# Altium project BEE_BOARD.PrjPcb (part 2 of 2)

## Sheet BEE_BOARD_DECAWAVE.SchDoc
size Tabloid; DocumentNumber: 7; SheetNumber: 7; SheetTotal: 7; Sheet_Name: DECAWAVE; Size: 11x17
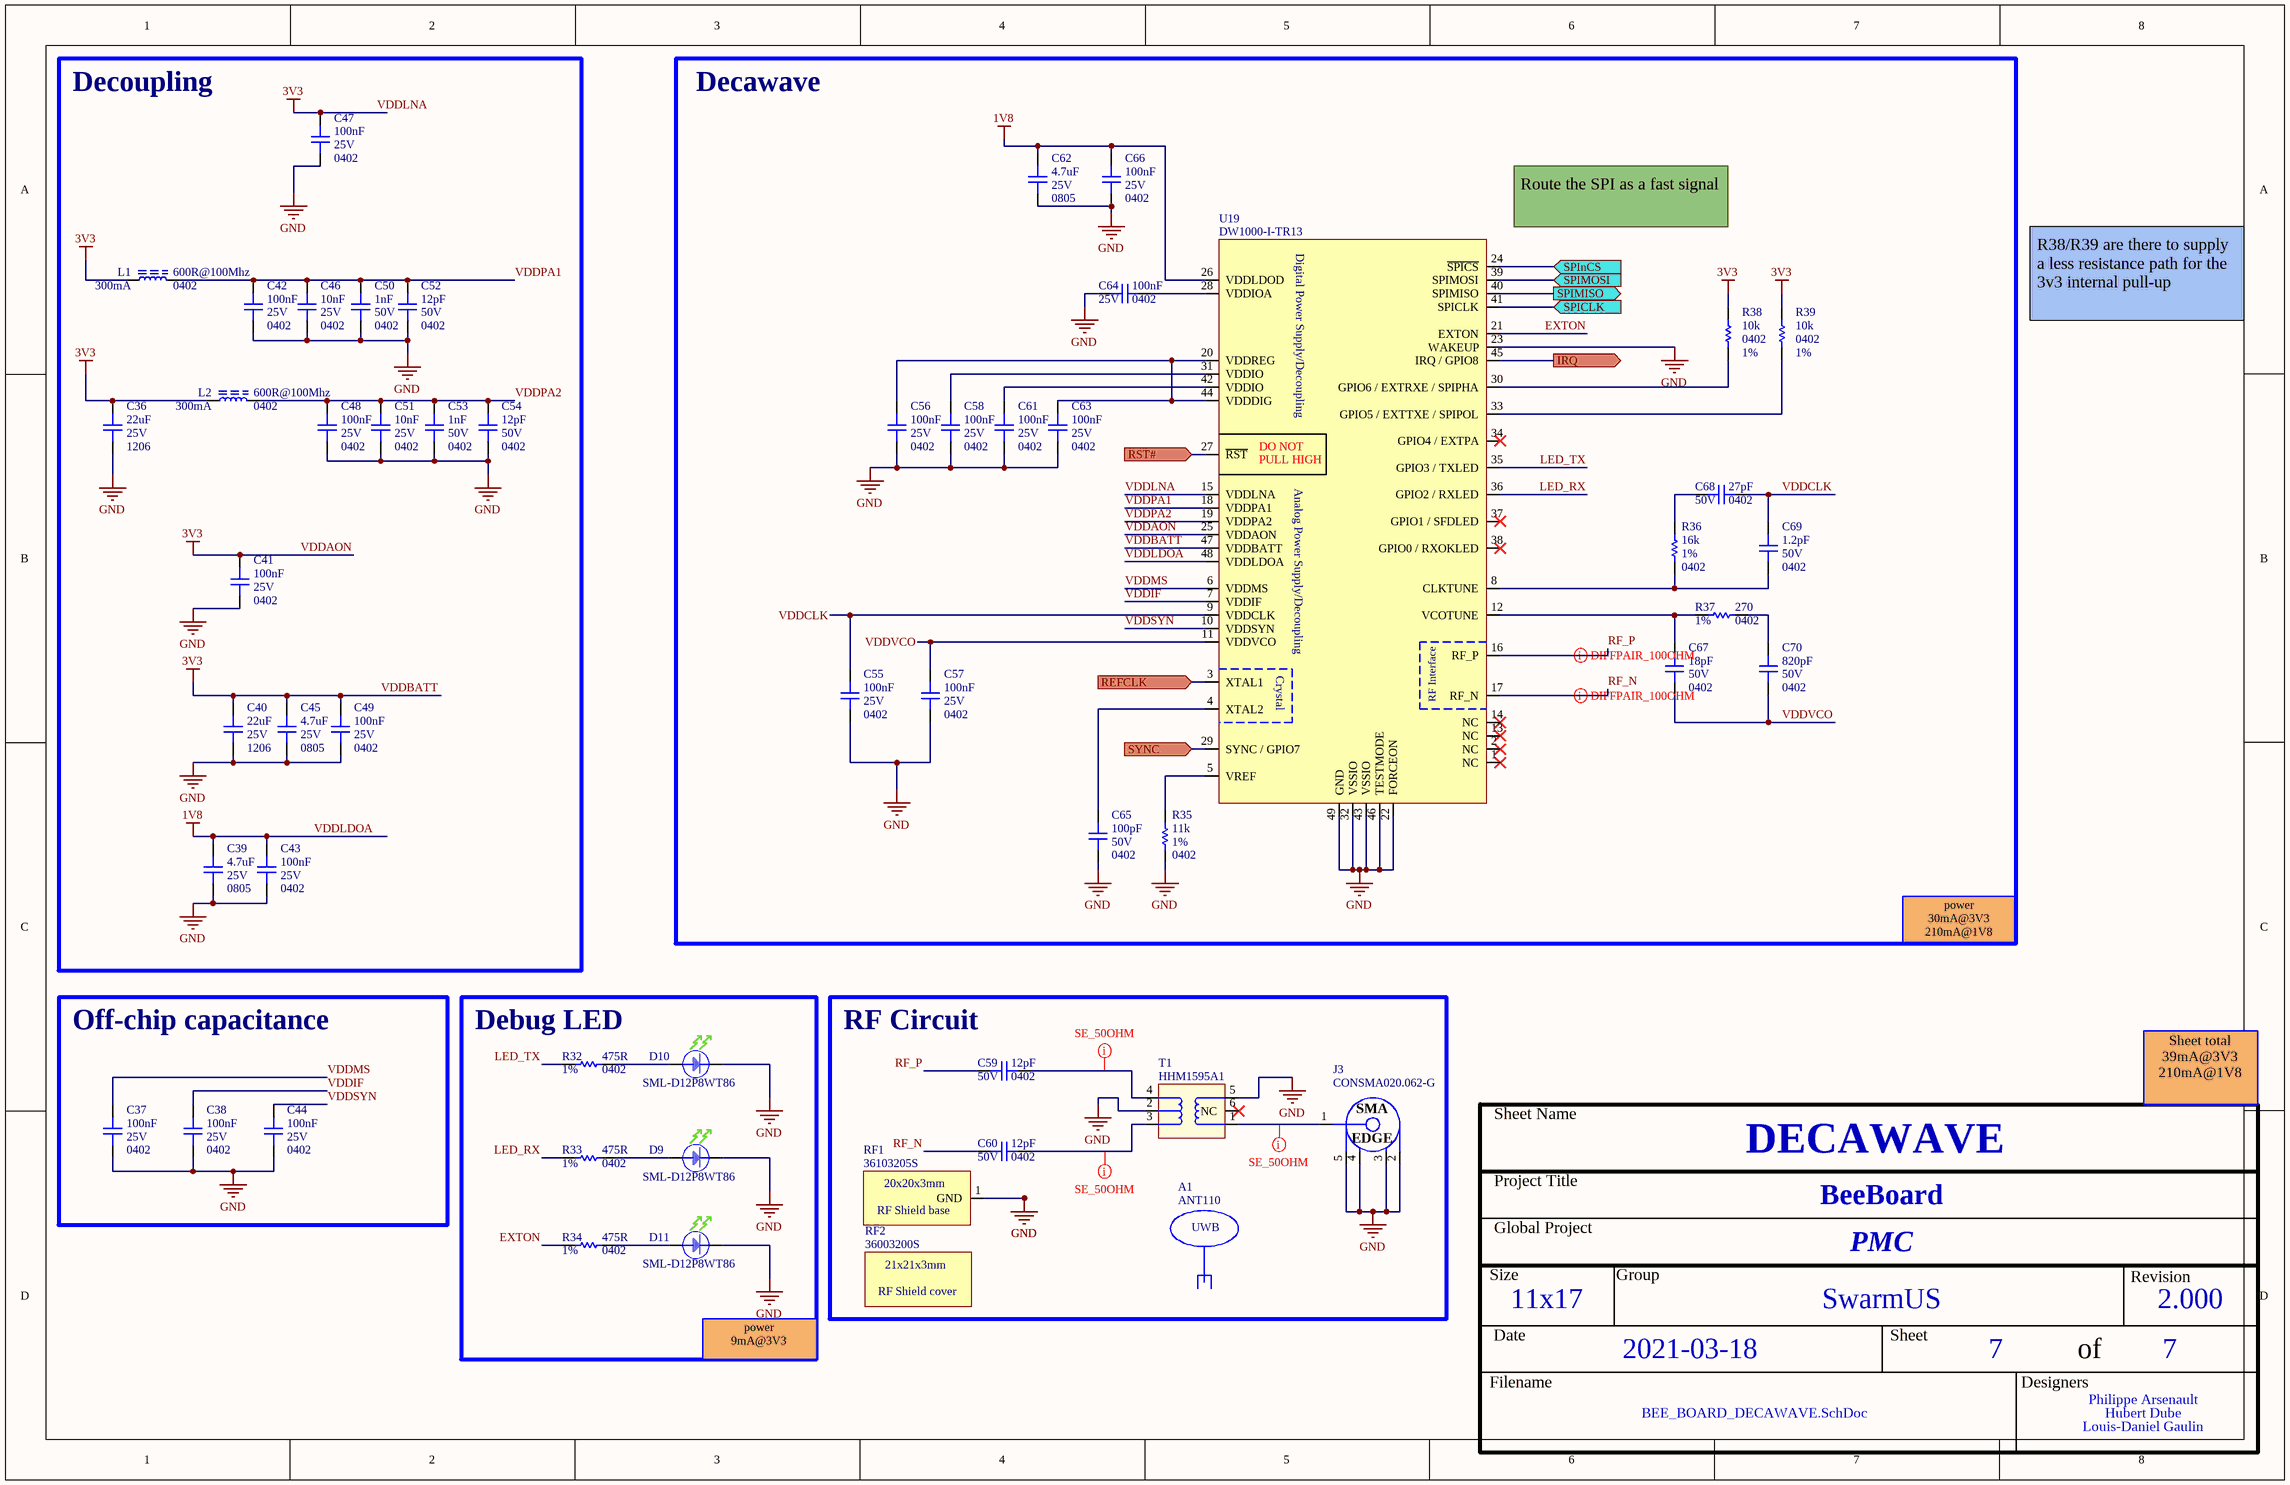
[diagram p4: BEE_BOARD_DECAWAVE.SchDoc]

### Parts
A1  ANT110  (mechanical)
C36  value 22uF  Package: 1206  Voltage Rating: 25V  [CAP_CER_1206]  (hidden comment: CL31A226KAHNNNE)
C37  value 100nF  Package: 0402  Voltage Rating: 25V  [CAP_CER_0402]  (hidden comment: CGA2B3X7R1E104K050BB)
C38  value 100nF  Package: 0402  Voltage Rating: 25V  [CAP_CER_0402]  (hidden comment: CGA2B3X7R1E104K050BB)
C39  value 4.7uF  Package: 0805  Voltage Rating: 25V  [CAP_CER_0805]  (hidden comment: C2012X7R1E475K125AE)
C40  value 22uF  Package: 1206  Voltage Rating: 25V  [CAP_CER_1206]  (hidden comment: CL31A226KAHNNNE)
C41  value 100nF  Package: 0402  Voltage Rating: 25V  [CAP_CER_0402]  (hidden comment: CGA2B3X7R1E104K050BB)
C42  value 100nF  Package: 0402  Voltage Rating: 25V  [CAP_CER_0402]  (hidden comment: CGA2B3X7R1E104K050BB)
C43  value 100nF  Package: 0402  Voltage Rating: 25V  [CAP_CER_0402]  (hidden comment: CGA2B3X7R1E104K050BB)
C44  value 100nF  Package: 0402  Voltage Rating: 25V  [CAP_CER_0402]  (hidden comment: CGA2B3X7R1E104K050BB)
C45  value 4.7uF  Package: 0805  Voltage Rating: 25V  [CAP_CER_0805]  (hidden comment: C2012X7R1E475K125AE)
C46  value 10nF  Package: 0402  Voltage Rating: 25V  [CAP_CER_0402]  (hidden comment: CL05B103KA5NNNC)
C47  value 100nF  Package: 0402  Voltage Rating: 25V  [CAP_CER_0402]  (hidden comment: CGA2B3X7R1E104K050BB)
C48  value 100nF  Package: 0402  Voltage Rating: 25V  [CAP_CER_0402]  (hidden comment: CGA2B3X7R1E104K050BB)
C49  value 100nF  Package: 0402  Voltage Rating: 25V  [CAP_CER_0402]  (hidden comment: CGA2B3X7R1E104K050BB)
C50  value 1nF  Package: 0402  Voltage Rating: 50V  [CAP_CER_0402]  (hidden comment: CC0402KRX7R9BB102)
C51  value 10nF  Package: 0402  Voltage Rating: 25V  [CAP_CER_0402]  (hidden comment: CL05B103KA5NNNC)
C52  value 12pF  Package: 0402  Voltage Rating: 50V  [CAP_CER_0402]  (hidden comment: CC0402JRNPO9BN120)
C53  value 1nF  Package: 0402  Voltage Rating: 50V  [CAP_CER_0402]  (hidden comment: CC0402KRX7R9BB102)
C54  value 12pF  Package: 0402  Voltage Rating: 50V  [CAP_CER_0402]  (hidden comment: CC0402JRNPO9BN120)
C55  value 100nF  Package: 0402  Voltage Rating: 25V  [CAP_CER_0402]  (hidden comment: CGA2B3X7R1E104K050BB)
C56  value 100nF  Package: 0402  Voltage Rating: 25V  [CAP_CER_0402]  (hidden comment: CGA2B3X7R1E104K050BB)
C57  value 100nF  Package: 0402  Voltage Rating: 25V  [CAP_CER_0402]  (hidden comment: CGA2B3X7R1E104K050BB)
C58  value 100nF  Package: 0402  Voltage Rating: 25V  [CAP_CER_0402]  (hidden comment: CGA2B3X7R1E104K050BB)
C59  value 12pF  Package: 0402  Voltage Rating: 50V  [CAP_CER_0402]  (hidden comment: CC0402JRNPO9BN120)
C60  value 12pF  Package: 0402  Voltage Rating: 50V  [CAP_CER_0402]  (hidden comment: CC0402JRNPO9BN120)
C61  value 100nF  Package: 0402  Voltage Rating: 25V  [CAP_CER_0402]  (hidden comment: CGA2B3X7R1E104K050BB)
C62  value 4.7uF  Package: 0805  Voltage Rating: 25V  [CAP_CER_0805]  (hidden comment: C2012X7R1E475K125AE)
C63  value 100nF  Package: 0402  Voltage Rating: 25V  [CAP_CER_0402]  (hidden comment: CGA2B3X7R1E104K050BB)
C64  value 100nF  Package: 0402  Voltage Rating: 25V  [CAP_CER_0402]  (hidden comment: CGA2B3X7R1E104K050BB)
C65  value 100pF  Package: 0402  Voltage Rating: 50V  [CAP_CER_0402]  (hidden comment: CC0402JRNPO9BN101)
C66  value 100nF  Package: 0402  Voltage Rating: 25V  [CAP_CER_0402]  (hidden comment: CGA2B3X7R1E104K050BB)
C67  value 18pF  Package: 0402  Voltage Rating: 50V  [CAP_CER_0402]  (hidden comment: GRM1555C1H180GA01D)
C68  value 27pF  Package: 0402  Voltage Rating: 50V  [CAP_CER_0402]  (hidden comment: CC0402JRNPO9BN270)
C69  value 1.2pF  Package: 0402  Voltage Rating: 50V  [CAP_CER_0402]  (hidden comment: C0402C129C5GACTU)
C70  value 820pF  Package: 0402  Voltage Rating: 50V  [CAP_CER_0402]  (hidden comment: CC0402KRX7R9BB821)
D9  SML-D12P8WT86  [LED_SML-D12P8WT86]
D10  SML-D12P8WT86  [LED_SML-D12P8WT86]
D11  SML-D12P8WT86  [LED_SML-D12P8WT86]
J3  CONSMA020.062-G  [CON_SMA_CONSMA020.062-G]
L1  value 600R@100Mhz  Current Rating: 300mA  Package: 0402  [FER_0402]  (hidden comment: BLM15AG601SN1D)
L2  value 600R@100Mhz  Current Rating: 300mA  Package: 0402  [FER_0402]  (hidden comment: BLM15AG601SN1D)
R32  value 475R  Tolerance: 1%  Package: 0402  [RES_0402]  (hidden comment: ERJ-2RKF4750X)
R33  value 475R  Tolerance: 1%  Package: 0402  [RES_0402]  (hidden comment: ERJ-2RKF4750X)
R34  value 475R  Tolerance: 1%  Package: 0402  [RES_0402]  (hidden comment: ERJ-2RKF4750X)
R35  value 11k  Tolerance: 1%  Package: 0402  [RES_0402]  (hidden comment: RC0402FR-0711KL)
R36  value 16k  Tolerance: 1%  Package: 0402  [RES_0402]  (hidden comment: RC0402FR-0716KL)
R37  value 270  Tolerance: 1%  Package: 0402  [FER_0402]  (hidden comment: RC0402FR-07270RL)
R38  value 10k  Tolerance: 1%  Package: 0402  [RES_0402]  (hidden comment: RC0402FR-0710KL)
R39  value 10k  Tolerance: 1%  Package: 0402  [RES_0402]  (hidden comment: RC0402FR-0710KL)
RF1  36103205S  [RF_SH_BASE_36103205S]
RF2  36003200S  [RF_SH_COVER_36003200S]  (mechanical)
T1  HHM1595A1  [XFR_HHM1595A1]
U19  DW1000-I-TR13  [COM_XCV_DW1000-I-TR13]

### Blocks framed on the sheet
Decoupling: C36 C39-C43 C45-C54 L1 L2
Decawave: C55-C58 C61-C70 R35-R39 U19
Off-chip capacitance: C37 C38 C44
Debug LED: D9-D11 R32-R34
RF Circuit: A1 C59 C60 J3 RF1 RF2 T1

### Ports
IRQ (out), REFCLK (in), RST# (in), SPICLK (in), SPIMISO (out), SPIMOSI (in), SPInCS (in), SYNC (in)

### Nets
1V8: C39.2 C43.2 C62.2 C66.2 U19.26(VDDLDOD) U19.48(VDDLDOA)  [also labelled VDDLDOA]
3V3: C36.2 C40.2 C41.2 C45.2 C47.2 C49.2 L1.1 L2.1 R38.1 R39.1 U19.15(VDDLNA) U19.25(VDDAON) U19.47(VDDBATT)  [also labelled VDDAON, VDDBATT, VDDLNA]
GND: C36.1 C37.1 C38.1 C39.1 C40.1 C41.1 C42.1 C43.1 C44.1 C45.1 C46.1 C47.1 C48.1 C49.1 C50.1 C51.1 C52.1 C53.1 C54.1 C55.1 C56.1 C57.1 C58.1 C61.1 C62.1 C63.1 C64.2 C65.1 C66.1 D9.K D10.K D11.K J3.2 J3.3 J3.4 J3.5 R35.1 RF1.1(GND) T1.2(GND) T1.5 U19.22(FORCEON) U19.23(WAKEUP) U19.32(VSSIO) U19.43(VSSIO) U19.46(TESTMODE) U19.49(GND)
CLK_OUT: U19.3(XTAL1) ; port REFCLK
DW_IRQ_BB: U19.45(IRQ_/_GPIO8) ; port IRQ
DW_RESET_BB: U19.27(~{RST}) ; port RST#
EXTON: R34.2 U19.21(EXTON)
LED_RX: R33.2 U19.36(GPIO2_/_RXLED)
LED_TX: R32.2 U19.35(GPIO3_/_TXLED)
RF_N: C60.2 U19.17(RF_N)
RF_P: C59.2 U19.16(RF_P)
SPICLK: U19.41(SPICLK) ; port SPICLK
SPIMISO: U19.40(SPIMISO) ; port SPIMISO
SPIMOSI: U19.39(SPIMOSI) ; port SPIMOSI
SPInCS: U19.24(~{SPICS}) ; port SPInCS
SYNC: U19.29(SYNC_/_GPIO7) ; port SYNC
VDDCLK: C55.2 C68.1 C69.2 U19.9(VDDCLK)
VDDIF: C38.2 U19.7(VDDIF)
VDDMS: C37.2 U19.6(VDDMS)
VDDPA1: C42.2 C46.2 C50.2 C52.2 L1.2 U19.18(VDDPA1)
VDDPA2: C48.2 C51.2 C53.2 C54.2 L2.2 U19.19(VDDPA2)
VDDSYN: C44.2 U19.10(VDDSYN)
VDDVCO: C57.2 C67.1 C70.1 U19.11(VDDVCO)
NetC56_2: C56.2 C63.2 U19.20(VDDREG) U19.44(VDDDIG)
NetC58_2: C58.2 U19.31(VDDIO)
NetC59_1: C59.1 T1.4
NetC60_1: C60.1 T1.3
NetC61_2: C61.2 U19.42(VDDIO)
NetC64_1: C64.1 U19.28(VDDIOA)
NetC65_2: C65.2 U19.4(XTAL2)
NetC67_2: C67.2 R37.2 U19.12(VCOTUNE)
NetC68_2: C68.2 R36.2
NetC69_1: C69.1 R36.1 U19.8(CLKTUNE)
NetC70_2: C70.2 R37.1
NetD9_A: D9.A R33.1
NetD10_A: D10.A R32.1
NetD11_A: D11.A R34.1
NetJ3_1: J3.1 T1.1
NetR35_2: R35.2 U19.5(VREF)
NetR38_2: R38.2 U19.30(GPIO6_/_EXTRXE_/_SPIPHA)
NetR39_2: R39.2 U19.33(GPIO5_/_EXTTXE_/_SPIPOL)

Not connected (* = marked no-connect by the designer): T1 6(NC)*; U19 1(NC)* 2(NC)* 13(NC)* 14(NC)* 34(GPIO4_/_EXTPA)* 37(GPIO1_/_SFDLED)* 38(GPIO0_/_RXOKLED)*

### Layout directives
net class SE_50OHM: NetC59_1, NetC60_1, NetJ3_1
differential pair; differential pair class DIFF_100: RF_N, RF_P

### Notes on the sheet
- (near U19) Route the SPI as a fast signal
- R38/R39 are there to supply a less resistance path for the 3v3 internal pull-up
- power
  30mA@3V3
  210mA@1V8
- Sheet total
  39mA@3V3
  210mA@1V8
- power
  9mA@3V3
- Sheet Name
- Project Title
- Global Project
- Size
- Group
- Revision
- Date
- Sheet
- of
- Filename
- Designers
- (in symbol ANT_ANT110) UWB
- (in symbol COM_XCV_DW1000-I-TR13) Digital Power Supply/Decoupling; DO NOT; PULL HIGH; Analog Power Supply/Decoupling; Crystal; RF Interface
- (in symbol CON_SMA_CONSMA020.062-G) SMA; EDGE
- (in symbol RF_SH_BASE_36103205S) RF Shield base
- (in symbol RF_SH_COVER_36003200S) RF Shield cover

### Library data of the parts
A1 = ANT_ANT110: ANT - UWB antenna 3.2 to 7GHz; Manufacturer #1: Ciholas; GRAMS Lib Spec: 2.7; Polarized: No; HelpURL: https://cuwb.io/products/ant110.pdf; CreatedBy/Date: Philippe Arsenault/2021-04-11; VerifiedBy: Louis-Daniel Gaulin / 14-04-2021; Assembly Type: SMA; Part Number #1: ANT110; Supplier 1: Ciholas; Supplier Part Number 1: ANT110
C36 C40 = CAP_CER_CL31A226KAHNNNE: CAP - CER 22uF 10% 25V X5R - 1206; Manufacturer #1: Samsung Electro-Mechanics; GRAMS Lib Spec: 2.8; Magnetic Material: Unknown; Polarized: NO; Assembly Type: SMD; CreatedBy/Date: Philippe Arsenault/21 Janvier 2020; Current Rating: *; HelpURL: http://www.samsungsem.com/global/support/product-search/mlcc/1207445_4880.html; Manufacturer #2: *; Note: *; Part Number #1: CL31A226KAHNNNE; Part Number #2: 1276-3047-1-ND; Power Max: *; Temperature: -55°C ~ 85°C; Tolerance: 10%; VerifiedBy: C.Paulin - 28/01/2020; Supplier 1: Digi-Key; Supplier Part Number 1: 1276-3047-1-ND; Cryo: UNKNOWN
C37 C38 C41-C44 C47-C49 C55-C58 C61 C63 C64 C66 = CAP_CER_CGA2B3X7R1E104K050BB: CAP - CER 0.1µF 10% 25V X7R - 0402; Manufacturer #1: TDK Corporation; GRAMS Lib Spec: 2.8; Magnetic Material: Unknown; Polarized: NO; Assembly Type: SMD; CreatedBy/Date: Nicolas Roy 2018-11-07; Current Rating: *; HelpURL: https://product.tdk.com/info/en/catalog/datasheets/mlcc_automotive_general_en.pdf; Manufacturer #2: *; Note: *; Part Number #1: CGA2B3X7R1E104K050BB; Part Number #2: *; Power Max: *; Temperature: -55°C ~ 125°C; Tolerance: 10%; VerifiedBy: Nicolas V. (2019-01-22); Supplier 1: Digi-Key; Supplier Part Number 1: 445-6902-1-ND; Cryo: UNKNOWN
C39 C45 C62 = CAP_CER_C2012X7R1E475K125AE: CAP - CER 4.7UF 10% 25V X7R - 0805; Manufacturer #1: TDK Corporation; GRAMS Lib Spec: 2.8; Magnetic Material: Unknown; Polarized: No; Tolerance: 10%; Current Rating: *; Power Max: *; HelpURL: https://product.tdk.com/info/en/documents/chara_sheet/C2012X7R1E475K125AE.pdf; CreatedBy/Date: Keven Deslandes - 2018/11/09; VerifiedBy: Nicolas Roy - 2018/12/11; Temperature: -55°C ~ 125°C; Manufacturer #2: *; Note: *; Assembly Type: SMD; Part Number #2: *; Part Number #1: C2012X7R1E475K125AE; Supplier 1: Digi-Key; Supplier Part Number 1: 445-14537-1-ND; Cryo: UNKNOWN
C46 C51 = CAP_CER_CL05B103KA5NNNC: CAP - CER 10nF 10% 25V X7R - 0402; Manufacturer #1: Samsung Electro-Mechanics; GRAMS Lib Spec: 2.8; Magnetic Material: YES; Polarized: NO; Cryo: UNKNOWN; Assembly Type: SMD; CreatedBy/Date: Romain Espagnet 2018-07-16; Current Rating: *; HelpURL: http://www.samsungsem.com/kr/support/product-search/mlcc/__icsFiles/afieldfile/2018/07/13/CL05B103KA5NNNC.pdf; Manufacturer #2: Murata Electronics North America; Note: *; Part Number #1: CL05B103KA5NNNC; Part Number #2: GRM155R71E103KA01D; Power Max: *; Temperature: -55°C ~ 125°C; Tolerance: 10%; VerifiedBy: Jonathan Bouchard 2018-07-30; Supplier 1: Digi-Key; Supplier Part Number 1: 1276-1057-1-ND
C50 C53 = CAP_CER_CC0402KRX7R9BB102: CAP - CER 1nF 10% 50V X7R - 0402; Manufacturer #1: Yageo; GRAMS Lib Spec: 2.8; Magnetic Material: UNKNOWN; Polarized: NO; Assembly Type: SMD; CreatedBy/Date: Jonathan Bouchard 2019-04-06; Current Rating: *; HelpURL: http://www.yageo.com/documents/recent/UPY-GPHC_X7R_6.3V-to-50V_18.pdf; Manufacturer #2: *; Note: *; Part Number #1: CC0402KRX7R9BB102; Part Number #2: *; Power Max: *; Temperature: -55°C ~ 125°C; Tolerance: 10%; VerifiedBy: Nicolas V. (2019-04-30); Supplier 1: Digi-Key; Supplier Part Number 1: 311-1036-1-ND; Cryo: UNKNOWN
C52 C54 C59 C60 = CAP_CER_CC0402JRNPO9BN120: CAP - CER 12pF 50V ±5% C0G, NP0 - 0402; Manufacturer #1: Yageo; GRAMS Lib Spec: 2.8; Magnetic Material: Unknown; Polarized: NO; Assembly Type: SMD; CreatedBy/Date: Philippe Arsenault/ 2020-07-24; Current Rating: *; HelpURL: https://www.yageo.com/upload/media/product/productsearch/datasheet/mlcc/UPY-GP_NP0_16V-to-50V_18.pdf; Manufacturer #2: *; Note: *; Part Number #1: CC0402JRNPO9BN120; Part Number #2: *; Power Max: *; Temperature: -55°C ~ 125°C; Tolerance: ±5%; VerifiedBy: Louis-Daniel Gaulin / 2020-07-29; Cryo: UNKNOWN; Supplier 1: Digi-Key; Supplier Part Number 1: 311-1016-1-ND
C65 = CAP_CER_CC0402JRNPO9BN101: CAP - CER 100pF 50V ±5% C0G,CP0 - 0402; Manufacturer #1: Yageo; GRAMS Lib Spec: 2.8; Magnetic Material: Unknown; Polarized: NO; Assembly Type: SMD; CreatedBy/Date: Philippe Arsenault/ 2020-07-24; Current Rating: *; HelpURL: https://www.yageo.com/upload/media/product/productsearch/datasheet/mlcc/UPY-GPHC_X7R_6.3V-to-50V_18.pdf; Manufacturer #2: *; Note: *; Part Number #1: CC0402JRNPO9BN101; Part Number #2: *; Power Max: *; Temperature: -55°C ~ 125°C; Tolerance: ±5%; VerifiedBy: Louis-Daniel Gaulin / 2020-07-29; Cryo: UNKNOWN; Supplier 1: Digi-Key; Supplier Part Number 1: 311-1024-1-ND
C67 = CAP_CER_GRM1555C1H180GA01D: CAP - CER 18pF 50V C0G, NPO - 0402; Manufacturer #1: Murata Electronics North America; Tolerance: 2%; GRAMS Lib Spec: 2.8; Note: Not for new Design; Magnetic Material: UNKNOWN; Polarized: NO; Current Rating: *; Power Max: *; HelpURL: https://psearch.en.murata.com/capacitor/product/GRM1555C1H180GA01%23.html; CreatedBy/Date: Tommy Rossignol / 2018-11-20; VerifiedBy: Caroline Paulin - 13 fév 2019; Temperature: -55°C ~ 125°C; Manufacturer #2: *; Assembly Type: SMD; Part Number #2: *; Part Number #1: GRM1555C1H180GA01D; Supplier 1: Digi-Key; Supplier Part Number 1: 490-6204-1-ND; Cryo: UNKNOWN
C68 = CAP_CER_CC0402JRNPO9BN270: CAP - CER 27pF 50V ±5% C0G, NP0 - 0402; Manufacturer #1: Yageo; GRAMS Lib Spec: 2.8; Magnetic Material: Unknown; Polarized: NO; Assembly Type: SMD; CreatedBy/Date: Philippe Arsenault/ 2020-07-24; Current Rating: *; HelpURL: https://www.yageo.com/upload/media/product/productsearch/datasheet/mlcc/UPY-GP_NP0_16V-to-50V_18.pdf; Manufacturer #2: *; Note: *; Part Number #1: CC0402JRNPO9BN270; Part Number #2: *; Power Max: *; Temperature: -55°C ~ 125°C; Tolerance: ±5%; VerifiedBy: Louis-Daniel Gaulin / 2020-07-29; Cryo: UNKNOWN; Supplier 1: Digi-Key; Supplier Part Number 1: 311-1019-1-ND
C69 = CAP_CER_C0402C129C5GACTU: CAP - CER 1.2pF 50V ±0.25pF C0G, NP0 - 0402; Manufacturer #1: KEMET; GRAMS Lib Spec: 2.8; Magnetic Material: Unknown; Polarized: NO; Assembly Type: SMD; CreatedBy/Date: Philippe Arsenault/ 2020-07-24; Current Rating: *; HelpURL: https://content.kemet.com/datasheets/KEM_C1003_C0G_SMD.pdf; Manufacturer #2: *; Note: *; Part Number #1: C0402C129C5GACTU; Part Number #2: *; Power Max: *; Temperature: -55°C ~ 125°C; Tolerance: ±0.25pF; VerifiedBy: Louis-Daniel Gaulin / 2020-07-29; Cryo: UNKNOWN; Supplier 1: Digi-Key; Supplier Part Number 1: 399-1001-1-ND
C70 = CAP_CER_CC0402KRX7R9BB821: CAP - CER 820pF 50V ±10% X7R - 0402; Manufacturer #1: Yageo; GRAMS Lib Spec: 2.8; Magnetic Material: Unknown; Polarized: NO; Assembly Type: SMD; CreatedBy/Date: Philippe Arsenault/ 2020-07-24; Current Rating: *; HelpURL: https://www.yageo.com/upload/media/product/productsearch/datasheet/mlcc/UPY-GPHC_X7R_6.3V-to-50V_18.pdf; Manufacturer #2: *; Note: *; Part Number #1: CC0402KRX7R9BB821; Part Number #2: *; Power Max: *; Temperature: -55°C ~ 125°C; Tolerance: ±10%; VerifiedBy: Louis-Daniel Gaulin / 2020-07-29; Cryo: UNKNOWN; Supplier 1: Digi-Key; Supplier Part Number 1: 311-1727-1-ND
D9-D11 = LED_SML-D12P8WT86: LED - GREEN DIFFUSED 0603 SMD - 0603; Manufacturer #1: Rohm Semiconductor; Current Rating: 1-20mA; Note: Operate at 2mA; Value: 560 nm (green); Voltage rating: 2.2V (Forward), 5V (max Reverse); Polarized: Yes; Magnetic Material: Unknown; GRAMS Lib Spec: 2.8; Manufacturer #2: *; Power Max: *; Part Number #1: SML-D12P8WT86; Part Number #2: *; HelpURL: https://d1d2qsbl8m0m72.cloudfront.net/en/products/databook/datasheet/opto/led/chip_mono/sml-d12x8_d13x8-e.pdf; Supplier 1: Digi-Key; Supplier Part Number 1: 511-1579-2-ND; Assembly Type: SMD; Temperature: -40 ~ 85 °C; Package: 0603; CreatedBy/Date: Keven Deslandes - 2018/11/21; Tolerance: *; VerifiedBy: Caroline Paulin - 13 février 2019; Cryo: UNKNOWN
J3 = CON_SMA_CONSMA020.062-G: CON_SMA FML EDGE MNT 0.062" PCB - 5-SMD; Manufacturer #1: Linx Technologies Inc.; GRAMS Lib Spec: 2.8; Magnetic Material: Unknown; Polarized: Yes; Value: 50 ohm; Voltage Rating: 500V; Assembly Type: SMD; CreatedBy/Date: Philippe Arsenault/2021-03-26; Current Rating: -; Part Number #1: CONSMA020.062-G; Part Number #2: TBD; Package: 5-SMD - EDGE; Power Max: -; Tolerance: -; HelpURL: https://linxtechnologies.com/wp/wp-content/uploads/consma020.062-g-ds.pdf; Temperature: -65°C ~ 165°C; Cryo: UNKNOWN; Supplier 1: Digi-Key; Supplier Part Number 1: 343-CONSMA020.062-G-ND
L1 L2 = FER_BLM15AG601SN1D: FER - FERRITE BEAD 600 OHM@100MHz - 0402; Manufacturer #1: Murata; GRAMS Lib Spec: 2.8; Magnetic Material: YES; Polarized: NO; Cryo: UNKNOWN; Tolerance: *; Voltage Rating: *; Power Max: *; HelpURL: https://www.murata.com/en-us/products/productdata/8796740059166/ENFA0018.pdf; CreatedBy/Date: Philippe Arsenault/2020-07-24; Temperature: -55°C ~ 125°C; Manufacturer #2: *; Note: *; Assembly Type: SMD; Part Number #2: *; Part Number #1: BLM15AG601SN1D; Supplier 1: Digi-Key; Supplier Part Number 1: 490-1006-1-ND
R32-R34 = RES_ERJ-2RKF4750X: RES - 475R 1% 1/10W- 0402; Manufacturer #1: Panasonic Electronic Components; GRAMS Lib Spec: 2.8; Power Max: 1/10W; Magnetic Material: Unknown; Polarized: No; Voltage Rating: 50V; Assembly Type: SMD; CreatedBy/Date: Keven Deslandes 2018-10-17; Current Rating: *; HelpURL: https://industrial.panasonic.com/cdbs/www-data/pdf/RDA0000/AOA0000C304.pdf; Manufacturer #2: *; Part Number #1: ERJ-2RKF4750X; Part Number #2: *; Temperature: -55°C ~ 155°C; VerifiedBy: Carolilne Paulin - 18/12/2018; Supplier 1: Digi-Key; Supplier Part Number 1: P475LCT-ND; Cryo: UNKNOWN
R35 = RES_RC0402FR-0711KL: RES - 11K 1% 1/16W - 0402; Manufacturer #1: Yageo; GRAMS Lib Spec: 2.8; Magnetic Material: Unknown; Polarized: No; Voltage Rating: 50V; Assembly Type: SMD; CreatedBy/Date: Keven Deslandes 2018-10-15; Current Rating: *; HelpURL: http://www.yageo.com/documents/recent/PYu-RC_Group_51_RoHS_L_9.pdf; Manufacturer #2: *; Part Number #1: RC0402FR-0711KL; Part Number #2: *; Power Max: 1/16W; Temperature: -55°C ~ 155°C; VerifiedBy: Carolilne Paulin - 18/12/2018; Supplier 1: Digi-Key; Supplier Part Number 1: 311-11.0KLRCT-ND; Cryo: UNKNOWN
R36 = RES_RC0402FR-0716KL: RES - 16k OHM 1% 1/16W - 0402; Manufacturer #1: Yageo; GRAMS Lib Spec: 2.8; Magnetic Material: Unknown; Polarized: NO; Voltage Rating: 50V; Assembly Type: SMD; CreatedBy/Date: Nicolas Roy/18 oct. 2018; Current Rating: *; HelpURL: http://www.yageo.com/documents/recent/PYu-RC_Group_51_RoHS_L_9.pdf; Manufacturer #2: *; Part Number #1: RC0402FR-0716KL; Part Number #2: *; Power Max: 1/16W; Temperature: -55°C ~ 155°C; VerifiedBy: Caroline Paulin - 18/12/2018; Supplier 1: Digi-Key; Supplier Part Number 1: 311-16.0KLRCT-ND; Cryo: UNKNOWN
R37 = RES_RC0402FR-07270RL: RES - 270R 1% 1/16W - 0402; Manufacturer #1: Yageo; GRAMS Lib Spec: 2.8c; Magnetic Material: Unknown; Polarized: No; Voltage Rating: 50V; Assembly Type: SMD; CreatedBy/Date: Philippe Arsenault 2020-07-24; Current Rating: *; HelpURL: https://www.yageo.com/upload/media/product/productsearch/datasheet/rchip/PYu-RC_Group_51_RoHS_L_10.pdf; Manufacturer #2: *; Note: *; Part Number #1: RC0402FR-07270RL; Part Number #2: *; Power Max: 1/16W; Temperature: -55°C ~ 155°C; VerifiedBy: Louis-Daniel Gaulin / 03-10-2020; Supplier 1: Digi-Key; Supplier Part Number 1: 311-270LRCT-ND
R38 R39 = RES_RC0402FR-0710KL: RES - 10K OHMS 1% 1/16W - 0402; Manufacturer #1: Yageo; GRAMS Lib Spec: 2.8; Magnetic Material: UNKNOWN; Polarized: NO; Voltage Rating: 50V; Assembly Type: SMD; CreatedBy/Date: Nicolas V. (2018-11-20); Current Rating: *; HelpURL: http://www.yageo.com/documents/recent/PYu-RC_Group_51_RoHS_L_9.pdf; Manufacturer #2: *; Note: *; Part Number #1: RC0402FR-0710KL; Part Number #2: *; Power Max: 1/16W; Temperature: -55°C ~ 155°C; VerifiedBy: Nicolas V. (2018-11-20); Supplier 1: Digi-Key; Supplier Part Number 1: 311-10.0KLRCT-ND; Cryo: UNKNOWN
RF1 = RF_SH_BASE_36103205S: RF_SH -  BASE RF SHIELD 0.787" X 0.787" SMD; Manufacturer #1: Würth Elektronik; Value: 20x20x3mm; GRAMS Lib Spec: 2.8; Note: Buy with 36003200S; Magnetic Material: Unknown; Polarized: No; HelpURL: https://www.we-online.de/katalog/datasheet/36903205S.pdf; CreatedBy/Date: Philippe Arsenault/2021-04-17; VerifiedBy: Louis-Daniel Gaulin / 29-04-2021; Temperature: -40°C ~ 125°C; Assembly Type: SMD; Part Number #1: 36103205S; Supplier 1: Digi-Key; Supplier Part Number 1: 732-11540-1-ND
RF2 = RF_SH_COVER_36003200S: RF_SH -  RF COVER 0.823" X 0.823" SMD; Manufacturer #1: Würth Elektronik; Value: 21x21x3mm; GRAMS Lib Spec: 2.8; Note: Buy with 36103205S; Magnetic Material: Unknown; Polarized: No; HelpURL: https://www.we-online.de/katalog/datasheet/36903205S.pdf; CreatedBy/Date: Philippe Arsenault/2021-04-17; VerifiedBy: Louis-Daniel Gaulin / 29-04-2021; Temperature: -40°C ~ 125°C; Assembly Type: SMD; Part Number #1: 36003200S; Supplier 1: Newark; Supplier Part Number 1: 37AC1129
T1 = XFR_HHM1595A1: XFR - Imp Unbalaced/Balanced 50/100 3-8GHz  -SMD; Manufacturer #1: TDK; Value: 3GHz  ~ 8GHz; GRAMS Lib Spec: 2.8; Magnetic Material: Unknown; Polarized: Yes; Tolerance: *; Voltage Rating: *; Current Rating: *; Power Max: *; HelpURL: https://product.tdk.com/info/en/documents/data_sheet/rf_balun_hhm1595a1_en.pdf; CreatedBy/Date: Philippe Arsenault/2020-21-07; VerifiedBy: Louis-Daniel Gaulin / 03-10-2020; Temperature: -40°C ~ 85°C; Package: 0805; Manufacturer #2: *; Note: *; Assembly Type: MT; Part Number #2: *; Part Number #1: HHM1595A1; Supplier 1: Digi-Key; Supplier Part Number 1: 445-3387-1-ND
U19 = COM_XCV_DW1000-I-TR13: COM - IC RF TxRx 802.15.4 IR-UWB DECAWAVE - 48-VFQFN EP; Voltage Rating: 2.8 - 3.6 V; Current Rating: Rx 64mA/Tx 31mA; GRAMS Lib Spec: 2.8; Magnetic Material: Unknown; Polarized: Yes; Cryo: No; Value: *; Tolerance: *; Power Max: *; HelpURL: https://www.decawave.com/sites/default/files/resources/DW1000-Datasheet-V2.12.pdf; CreatedBy/Date: Philippe Arsenault/13-07-2020; Temperature: -40°C ~ 85°C; Package: QFN 48; Manufacturer #1: Decawave; Manufacturer #2: Qorvo; Note: *; Assembly Type: SMT; Part Number #2: *; Part Number #1: DW1000-I-TR13; Supplier 1: Digi-Key; Supplier Part Number 1: 1479-1001-1-ND

## Sheet BEE_BOARD_USB_C_POLARITY.SchDoc
size Tabloid; DocumentNumber: 6; SheetNumber: 6; SheetTotal: 7; Sheet_Name: USB Polarity Check; Size: 11x17
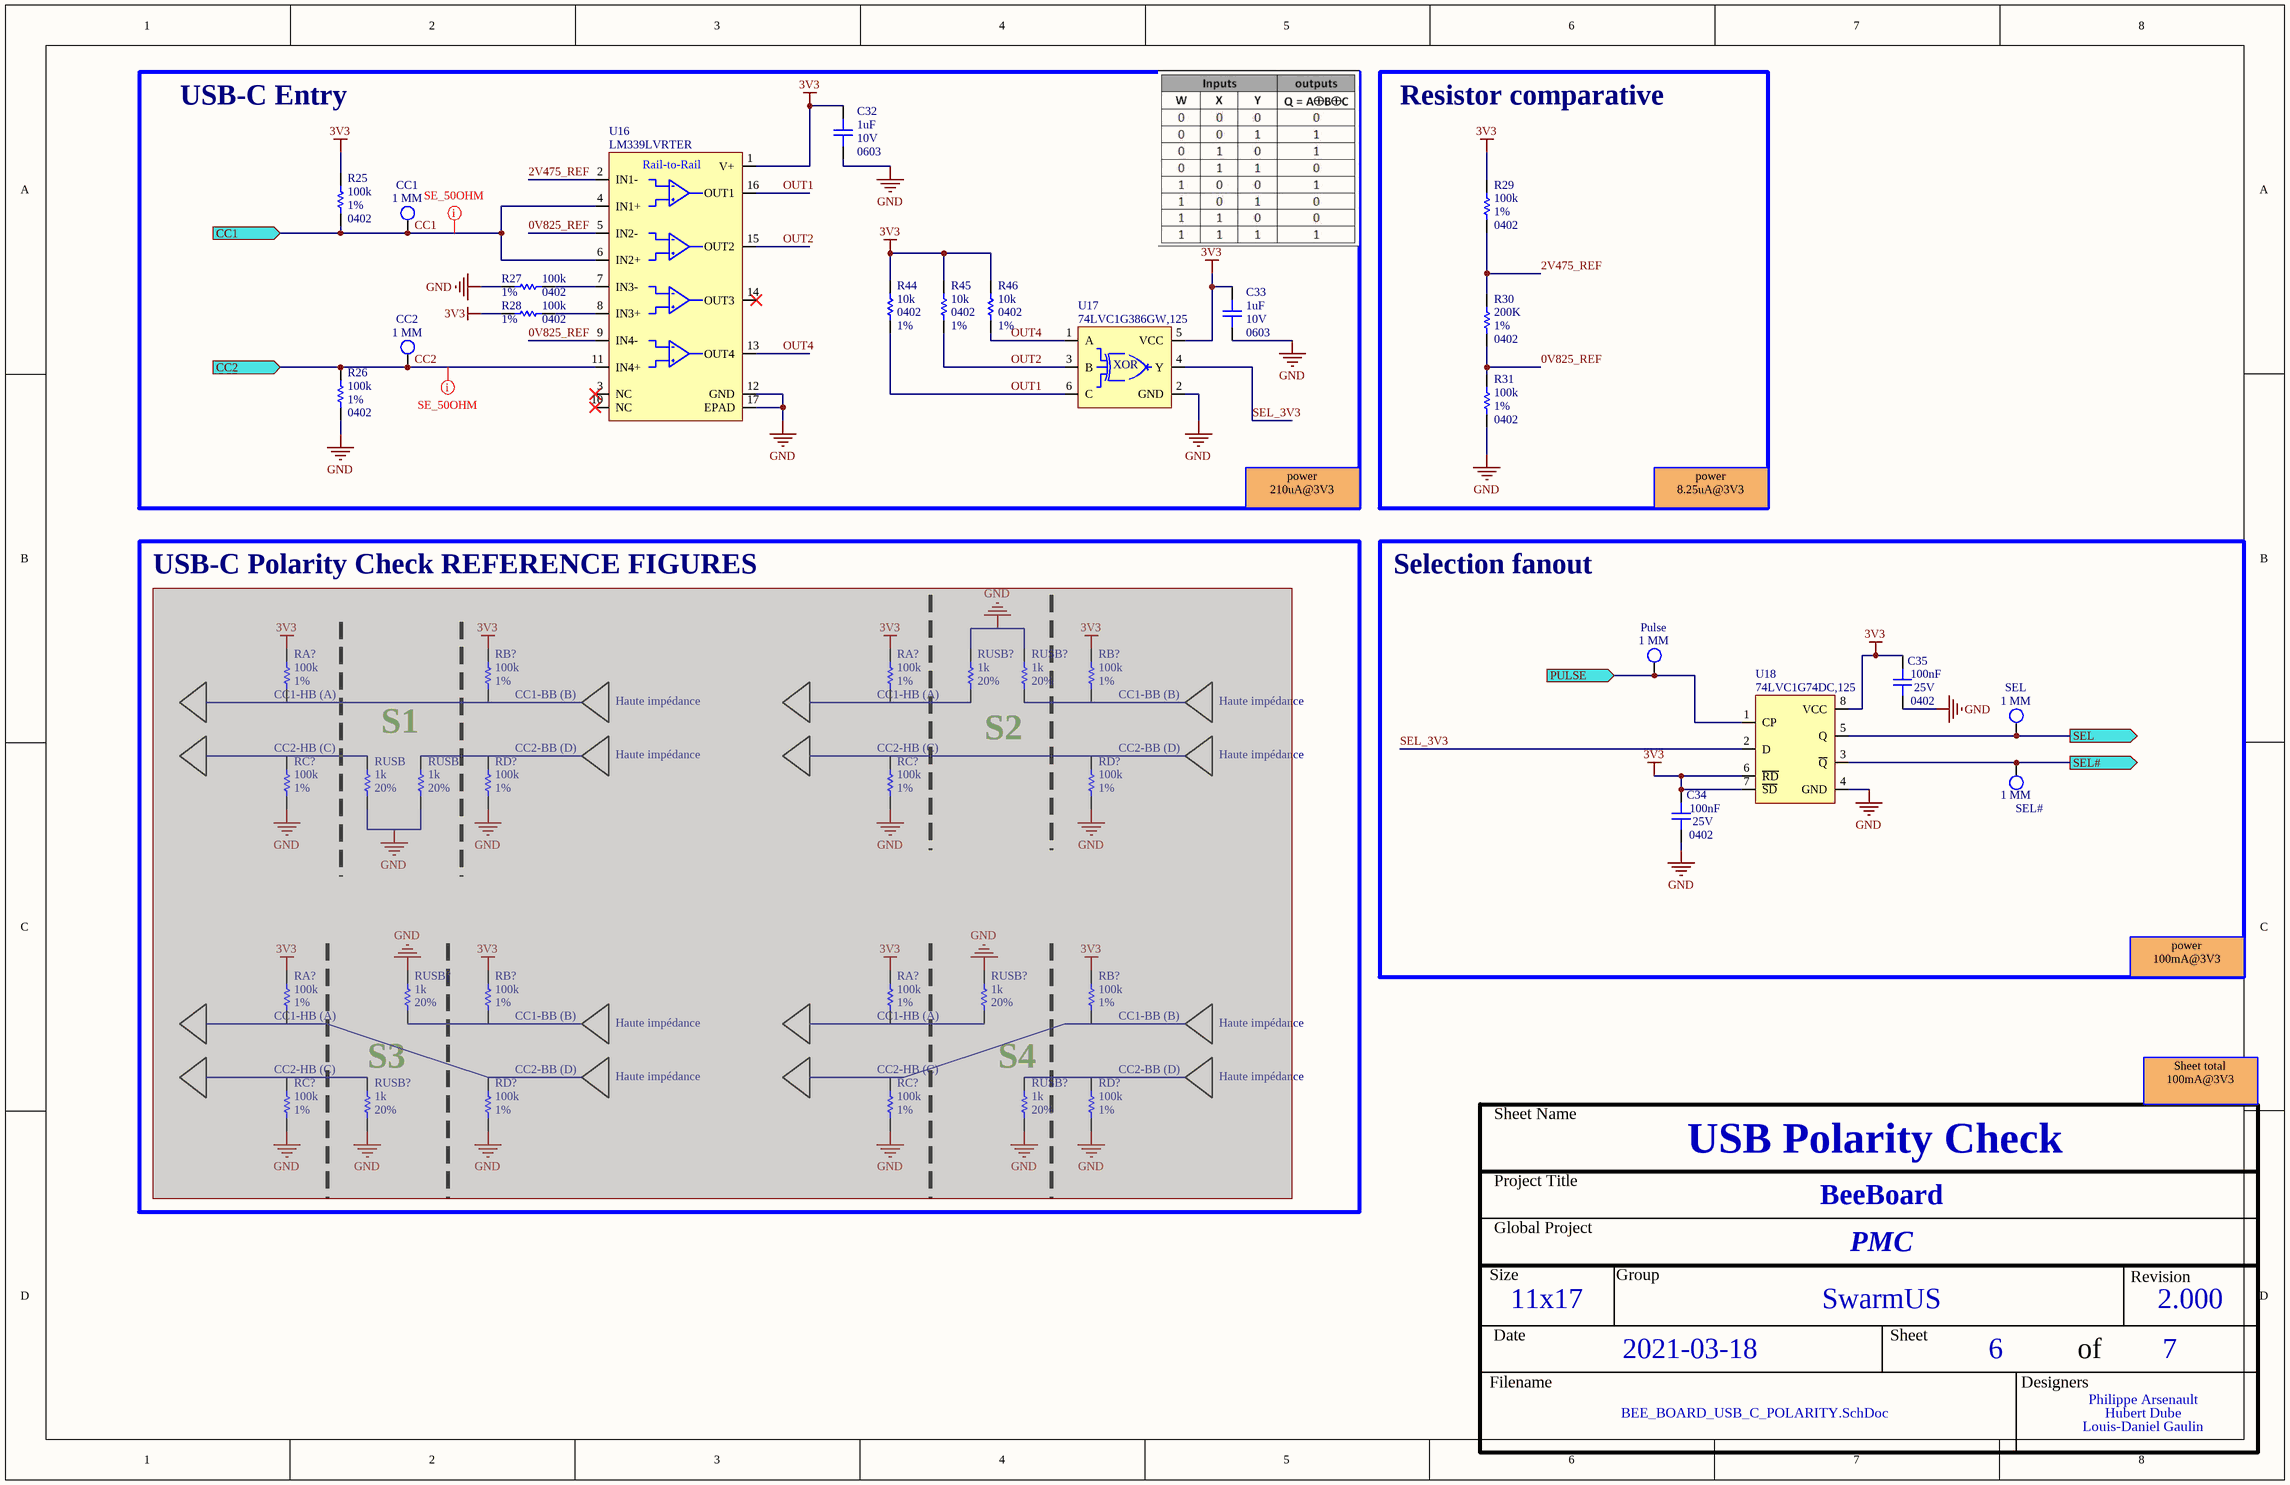
[diagram p5: BEE_BOARD_USB_C_POLARITY.SchDoc]

### Parts
(Parts that share a designator on the sheet are numbered #1, #2 ... from top to bottom, then left to right.)
C32  value 1uF  Package: 0603  Voltage Rating: 10V  [CAP_CER_0603]  (hidden comment: C0603C105K8PACTU)
C33  value 1uF  Package: 0603  Voltage Rating: 10V  [CAP_CER_0603]  (hidden comment: C0603C105K8PACTU)
C34  value 100nF  Package: 0402  Voltage Rating: 25V  [CAP_CER_0402]  (hidden comment: CGA2B3X7R1E104K050BB)
C35  value 100nF  Package: 0402  Voltage Rating: 25V  [CAP_CER_0402]  (hidden comment: CGA2B3X7R1E104K050BB)
CC1  1 MM  [TPO_SMD_ROUND_1MM]  (no BOM)
CC2  1 MM  [TPO_SMD_ROUND_1MM]  (no BOM)
Pulse  1 MM  [TPO_SMD_ROUND_1MM]  (no BOM)
R25  value 100k  Tolerance: 1%  Package: 0402  [RES_0402]  (hidden comment: RC0402FR-07100KL)
R26  value 100k  Tolerance: 1%  Package: 0402  [RES_0402]  (hidden comment: RC0402FR-07100KL)
R27  value 100k  Tolerance: 1%  Package: 0402  [RES_0402]  (hidden comment: RC0402FR-07100KL)
R28  value 100k  Tolerance: 1%  Package: 0402  [RES_0402]  (hidden comment: RC0402FR-07100KL)
R29  value 100k  Tolerance: 1%  Package: 0402  [RES_0402]  (hidden comment: RC0402FR-07100KL)
R30  value 200K  Tolerance: 1%  Package: 0402  [RES_0402]  (hidden comment: RMCF0402FT200K)
R31  value 100k  Tolerance: 1%  Package: 0402  [RES_0402]  (hidden comment: RC0402FR-07100KL)
R44  value 10k  Tolerance: 1%  Package: 0402  [RES_0402]  (hidden comment: RC0402FR-0710KL)
R45  value 10k  Tolerance: 1%  Package: 0402  [RES_0402]  (hidden comment: RC0402FR-0710KL)
R46  value 10k  Tolerance: 1%  Package: 0402  [RES_0402]  (hidden comment: RC0402FR-0710KL)
RA?#1  value 100k  Tolerance: 1%  [RES_0402]  (hidden comment: RC0402FR-07100KL)  (masked out: inside a compile mask, not in the netlist)
RA?#2  value 100k  Tolerance: 1%  [RES_0402]  (hidden comment: RC0402FR-07100KL)  (masked out: inside a compile mask, not in the netlist)
RA?#3  value 100k  Tolerance: 1%  [RES_0402]  (hidden comment: RC0402FR-07100KL)  (masked out: inside a compile mask, not in the netlist)
RA?#4  value 100k  Tolerance: 1%  [RES_0402]  (hidden comment: RC0402FR-07100KL)  (masked out: inside a compile mask, not in the netlist)
RB?#1  value 100k  Tolerance: 1%  [RES_0402]  (hidden comment: RC0402FR-07100KL)  (masked out: inside a compile mask, not in the netlist)
RB?#2  value 100k  Tolerance: 1%  [RES_0402]  (hidden comment: RC0402FR-07100KL)  (masked out: inside a compile mask, not in the netlist)
RB?#3  value 100k  Tolerance: 1%  [RES_0402]  (hidden comment: RC0402FR-07100KL)  (masked out: inside a compile mask, not in the netlist)
RB?#4  value 100k  Tolerance: 1%  [RES_0402]  (hidden comment: RC0402FR-07100KL)  (masked out: inside a compile mask, not in the netlist)
RC?#1  value 100k  Tolerance: 1%  [RES_0402]  (hidden comment: RC0402FR-07100KL)  (masked out: inside a compile mask, not in the netlist)
RC?#2  value 100k  Tolerance: 1%  [RES_0402]  (hidden comment: RC0402FR-07100KL)  (masked out: inside a compile mask, not in the netlist)
RC?#3  value 100k  Tolerance: 1%  [RES_0402]  (hidden comment: RC0402FR-07100KL)  (masked out: inside a compile mask, not in the netlist)
RC?#4  value 100k  Tolerance: 1%  [RES_0402]  (hidden comment: RC0402FR-07100KL)  (masked out: inside a compile mask, not in the netlist)
RD?#1  value 100k  Tolerance: 1%  [RES_0402]  (hidden comment: RC0402FR-07100KL)  (masked out: inside a compile mask, not in the netlist)
RD?#2  value 100k  Tolerance: 1%  [RES_0402]  (hidden comment: RC0402FR-07100KL)  (masked out: inside a compile mask, not in the netlist)
RD?#3  value 100k  Tolerance: 1%  [RES_0402]  (hidden comment: RC0402FR-07100KL)  (masked out: inside a compile mask, not in the netlist)
RD?#4  value 100k  Tolerance: 1%  [RES_0402]  (hidden comment: RC0402FR-07100KL)  (masked out: inside a compile mask, not in the netlist)
RUSB#1  value 1k  Tolerance: 20%  [RES_0402]  (hidden comment: ERA-2ARB102X)  (masked out: inside a compile mask, not in the netlist)
RUSB#2  value 1k  Tolerance: 20%  [RES_0402]  (hidden comment: ERA-2ARB102X)  (masked out: inside a compile mask, not in the netlist)
RUSB?#1  value 1k  Tolerance: 20%  [RES_0402]  (hidden comment: ERA-2ARB102X)  (masked out: inside a compile mask, not in the netlist)
RUSB?#2  value 1k  Tolerance: 20%  [RES_0402]  (hidden comment: ERA-2ARB102X)  (masked out: inside a compile mask, not in the netlist)
RUSB?#3  value 1k  Tolerance: 20%  [RES_0402]  (hidden comment: ERA-2ARB102X)  (masked out: inside a compile mask, not in the netlist)
RUSB?#4  value 1k  Tolerance: 20%  [RES_0402]  (hidden comment: ERA-2ARB102X)  (masked out: inside a compile mask, not in the netlist)
RUSB?#5  value 1k  Tolerance: 20%  [RES_0402]  (hidden comment: ERA-2ARB102X)  (masked out: inside a compile mask, not in the netlist)
RUSB?#6  value 1k  Tolerance: 20%  [RES_0402]  (hidden comment: ERA-2ARB102X)  (masked out: inside a compile mask, not in the netlist)
SEL  1 MM  [TPO_SMD_ROUND_1MM]  (no BOM)
SEL#  1 MM  [TPO_SMD_ROUND_1MM]  (no BOM)
U16  LM339LVRTER  [CMP_LM339LVRTER]
U17  74LVC1G386GW,125  [LOG_XOR_74LVC1G386GW,125]
U18  74LVC1G74DC,125  [LOG_FLIPFLOP_74LVC1G74DC,125]

### Blocks framed on the sheet
USB-C Entry: C32 C33 CC1 CC2 R25-R28 R44-R46 U16 U17
Resistor comparative: R29-R31
Selection fanout: C34 C35 Pulse SEL SEL# U18

### Ports
CC1 (in), CC2 (in), PULSE (in), SEL (out), SEL# (out)

### Nets
3V3: C32.1 C33.1 C34.2 C35.2 R25.2 R28.2 R29.2 R44.2 R45.2 R46.2 U16.1(V+) U17.5(VCC) U18.6(~{RD}) U18.7(~{SD}) U18.8(VCC)
GND: C32.2 C33.2 C34.1 C35.1 R26.1 R27.2 R31.1 U16.12(GND) U16.17(EPAD) U17.2(GND) U18.4(GND)
0V825_REF: R30.1 R31.2 U16.5(IN2-) U16.9(IN4-)
2V475_REF: R29.1 R30.2 U16.2(IN1-)
CC1: CC1.1 R25.1 U16.4(IN1+) U16.6(IN2+) ; port CC1
CC2: CC2.1 R26.2 U16.11(IN4+) ; port CC2
OUT1: R44.1 U16.16(OUT1) U17.6(C)
OUT2: R45.1 U16.15(OUT2) U17.3(B)
OUT4: R46.1 U16.13(OUT4) U17.1(A)
PULSE: Pulse.1 U18.1(CP) ; port PULSE
SEL: SEL.1 U18.5(Q) ; port SEL
SEL#: SEL#.1 U18.3(~{Q}) ; port SEL#
SEL_3V3: U17.4(Y) U18.2(D)
NetR27_1: R27.1 U16.7(IN3-)
NetR28_1: R28.1 U16.8(IN3+)

Not connected (* = marked no-connect by the designer): U16 3(NC)* 10(NC)* 14(OUT3)*

### Layout directives
net class SE_50OHM: CC1, CC2

### Notes on the sheet
- power
  210uA@3V3
- power
  8.25uA@3V3
- USB-C Polarity Check REFERENCE FIGURES
- (near RA?#1) CC1-HB (A)
- (near RB?#1) CC1-BB (B)
- Haute impédance
- (near RA?#2) CC1-HB (A)
- (near RB?#2) CC1-BB (B)
- (near RC?#1) CC2-HB (C)
- (near RUSB#2) S1
- (near RD?#1) CC2-BB (D)
- (near RC?#2) CC2-HB (C)
- (near RUSB?#2) S2
- (near RD?#2) CC2-BB (D)
- power
  100mA@3V3
- (near RA?#3) CC1-HB (A)
- (near RB?#3) CC1-BB (B)
- (near RA?#4) CC1-HB (A)
- (near RB?#4) CC1-BB (B)
- (near RC?#3) CC2-HB (C)
- (near RUSB?#5) S3
- (near RD?#3) CC2-BB (D)
- (near RC?#4) CC2-HB (C)
- (near RUSB?#6) S4
- (near RD?#4) CC2-BB (D)
- Sheet total
  100mA@3V3
- Sheet Name
- Project Title
- Global Project
- Size
- Group
- Revision
- Date
- Sheet
- of
- Filename
- Designers
- (in symbol CMP_LM339LVRTER) Rail-to-Rail
- (in symbol LOG_XOR_74LVC1G386GW,125) XOR

### Library data of the parts
C32 C33 = CAP_CER_C0603C105K8PACTU: CAP - CER 1uF 10V 10% X5R - 0603; Manufacturer #1: KEMET; GRAMS Lib Spec: 2.8; Magnetic Material: Unknown; Polarized: NO; Tolerance: 10%; Current Rating: *; Power Max: *; HelpURL: https://content.kemet.com/datasheets/KEM_C1006_X5R_SMD.pdf; CreatedBy/Date: Hubert Dube - 21/07/20; VerifiedBy: Louis-Daniel Gaulin - 21/07/20; Temperature: -55°C ~ 85°C; Manufacturer #2: *; Assembly Type: SMD; Part Number #2: *; Part Number #1: C0603C105K8PACTU; Cryo: UNKNOWN; Supplier 1: Digi-Key; Supplier Part Number 1: 399-3118-1-ND
C34 C35 = CAP_CER_CGA2B3X7R1E104K050BB: as C37 on sheet BEE_BOARD_DECAWAVE; Assembly Type: SMD; CreatedBy/Date: Nicolas Roy 2018-11-07; Current Rating: *; HelpURL: https://product.tdk.com/info/en/catalog/datasheets/mlcc_automotive_general_en.pdf; Manufacturer #2: *; Note: *; Part Number #1: CGA2B3X7R1E104K050BB; Part Number #2: *; Power Max: *; Temperature: -55°C ~ 125°C; Tolerance: 10%; VerifiedBy: Nicolas V. (2019-01-22); Supplier 1: Digi-Key; Supplier Part Number 1: 445-6902-1-ND; Cryo: UNKNOWN
CC1 CC2 Pulse SEL SEL# = TPO_SMD_ROUND_1MM: TPO - TEST POINT ROUND SMD PAD ONLY  - 1 MM; Magnetic Material: NO; GRAMS Lib Spec: 2.8; Cryo: UNKNOWN; Current Rating: *; Manufacturer #1: *; Manufacturer #2: *; Note: *; Power Max: *; Value: *; Part Number #1: *; Part Number #2: *; HelpURL: *; Polarized: *; Supplier 1: *; Assembly Type: NONE; Supplier Part Number 1: *; Package: 1 MM ROUND; CreatedBy/Date: Jonathan Bouchard 2018-07-17; Temperature: *; Tolerance: *; VerifiedBy: Arnaud Samson 23-07-18; Voltage Rating: *
R25-R29 R31 RA?#1-RA?#4 RB?#1-RB?#4 RC?#1-RC?#4 RD?#1-RD?#4 = RES_RC0402FR-07100KL: RES - 100K 1% 1/16W - 0402; Manufacturer #1: Yageo; GRAMS Lib Spec: 2.8; Magnetic Material: Unknown; Polarized: No; Voltage Rating: 50V; Assembly Type: SMD; CreatedBy/Date: Keven Deslandes 2018-10-19; Current Rating: *; HelpURL: http://www.yageo.com/documents/recent/PYu-RC_Group_51_RoHS_L_9.pdf; Manufacturer #2: *; Part Number #1: RC0402FR-07100KL; Part Number #2: *; Power Max: 1/16W; Temperature: -55°C ~ 155°C; VerifiedBy: Caroline Paulin - 18/12/2018; Supplier 1: Digi-Key; Supplier Part Number 1: 311-100KLRCT-ND; Cryo: UNKNOWN
R30 = RES_RMCF0402FT200K: RES -  200k ±1% 0.063W, 1/16W Chip Resistor 0402 (1005 Metric) Automotive AEC-Q200 Thick Film; Manufacturer #1: Stackpole Electronics Inc.; GRAMS Lib Spec: 2.8; Magnetic Material: Unknown; Polarized: No; Voltage Rating: 50V; Assembly Type: SMD; CreatedBy/Date: Philippe Arsenault/2021-04-14; Current Rating: *; HelpURL: https://www.seielect.com/catalog/sei-rmcf_rmcp.pdf; Manufacturer #2: *; Note: *; Part Number #1: RMCF0402FT200K; Part Number #2: *; Power Max: 1/16W; Temperature: -55°C ~ 155°C; VerifiedBy: Louis-Daniel Gaulin / 14-04-2021; Supplier 1: Digi-Key; Supplier Part Number 1: RMCF0402FT200KCT-ND
R44-R46 = RES_RC0402FR-0710KL: as R38 on sheet BEE_BOARD_DECAWAVE; Assembly Type: SMD; CreatedBy/Date: Nicolas V. (2018-11-20); Current Rating: *; HelpURL: http://www.yageo.com/documents/recent/PYu-RC_Group_51_RoHS_L_9.pdf; Manufacturer #2: *; Note: *; Part Number #1: RC0402FR-0710KL; Part Number #2: *; Power Max: 1/16W; Temperature: -55°C ~ 155°C; VerifiedBy: Nicolas V. (2018-11-20); Supplier 1: Digi-Key; Supplier Part Number 1: 311-10.0KLRCT-ND; Cryo: UNKNOWN
RUSB#1 RUSB#2 RUSB?#1-RUSB?#6 = RES_ERA-2ARB102X: RES - 1K OHM 0.1% 1/16W - 0402; Manufacturer #1: Panasonic Electronic Components; GRAMS Lib Spec: 2.8; Magnetic Material: UNKNOWN; Polarized: NO; Voltage Rating: 50V; Assembly Type: SMD; CreatedBy/Date: Jonathan Bouchard 2018-07-06; Current Rating: *; HelpURL: https://industrial.panasonic.com/cdbs/www-data/pdf/RDM0000/AOA0000C307.pdf; Manufacturer #2: TE Connectivity Passive Product; Note: *; Part Number #1: ERA-2ARB102X; Part Number #2: RN73C1E1K0BTD; Power Max: 1/16W; Temperature: -55°C ~ 155°C; VerifiedBy: Arnaud Samson 16-07-18; Supplier 1: Digi-Key; Supplier Part Number 1: P1KCPCT-ND; Cryo: UNKNOWN
U16 = CMP_LM339LVRTER: COMP - Quad Comparator General Purpose Open-Drain, Rail-to-Rail - 16-WQFN (3x3); Manufacturer #1: Texas instrument; Voltage Rating: 1.65V ~ 5.5V; Current Rating: 100mA@5V (SC); GRAMS Lib Spec: 2.8; Magnetic Material: Unknown; Polarized: Yes; Power Max: -; HelpURL: https://www.ti.com/lit/ds/symlink/lm339lv.pdf?ts=1618013735062; CreatedBy/Date: Philippe Arsenault/2021-04-10; VerifiedBy: Louis-Daniel Gaulin / 14-04-2021; Temperature: -40°C ~ 125°C (TA); Package: 16-WFQFN Exposed Pad; Assembly Type: SMD; Part Number #1: LM339LVRTER; Supplier 1: Digi-Key; Supplier Part Number 1: 296-LM339LVRTERCT-ND
U17 = LOG_XOR_74LVC1G386GW,125: LOG -  XOR (Exclusive OR) IC 1 Channel 3 inputs- 6-TSSOP; Manufacturer #1: Nexperia USA Inc.; Value: XOR Gate 5V 3 in; Voltage Rating: 1.65V ~ 5.5V; Current Rating: 100mA (supply) , 50mA (out); Power Max: 250mW; GRAMS Lib Spec: 2.8; Magnetic Material: Unknown; Polarized: Yes; HelpURL: https://assets.nexperia.com/documents/data-sheet/74LVC1G386.pdf; CreatedBy/Date: Philippe Arsenault/2021-04-10; VerifiedBy: Louis-Daniel Gaulin / 14-04-2021; Temperature: -40°C ~ 125°C (TA); Package: 6-TSSOP; Assembly Type: SMD; Part Number #1: 74LVC1G386GW,125; Supplier 1: Digi-Key; Supplier Part Number 1: 1727-6982-1-ND
U18 = LOG_FLIPFLOP_74LVC1G74DC,125: LOG_FLIPFLOP - D-Type Flip Flop Bit Positive Edge with asynchronous operation - 8-VSSOP; Manufacturer #1: Nexperia USA Inc.; Voltage Rating: 1.65V ~ 5.5V; Current Rating: 32mA output; Power Max: 300mW; GRAMS Lib Spec: 2.8; Magnetic Material: Unknown; Polarized: Yes; HelpURL: https://assets.nexperia.com/documents/data-sheet/74LVC1G74.pdf; CreatedBy/Date: Philippe Arsenault/2021-04-14; VerifiedBy: Louis-Daniel Gaulin / 16-04-2021; Temperature: -40°C ~ 125°C (TA); Package: VSSOP-8; Assembly Type: SMD; Part Number #1: 74LVC1G74DC,125; Supplier 1: Digi-Key; Supplier Part Number 1: 1727-4029-1-ND

## Sheet BEE_BOARD_BLOCK_DIAG.SchDoc
size Tabloid; DocumentNumber: 2; SheetNumber: 2; SheetTotal: 7; Sheet_Name: Insert name in Document Parameters; Size: 11x17
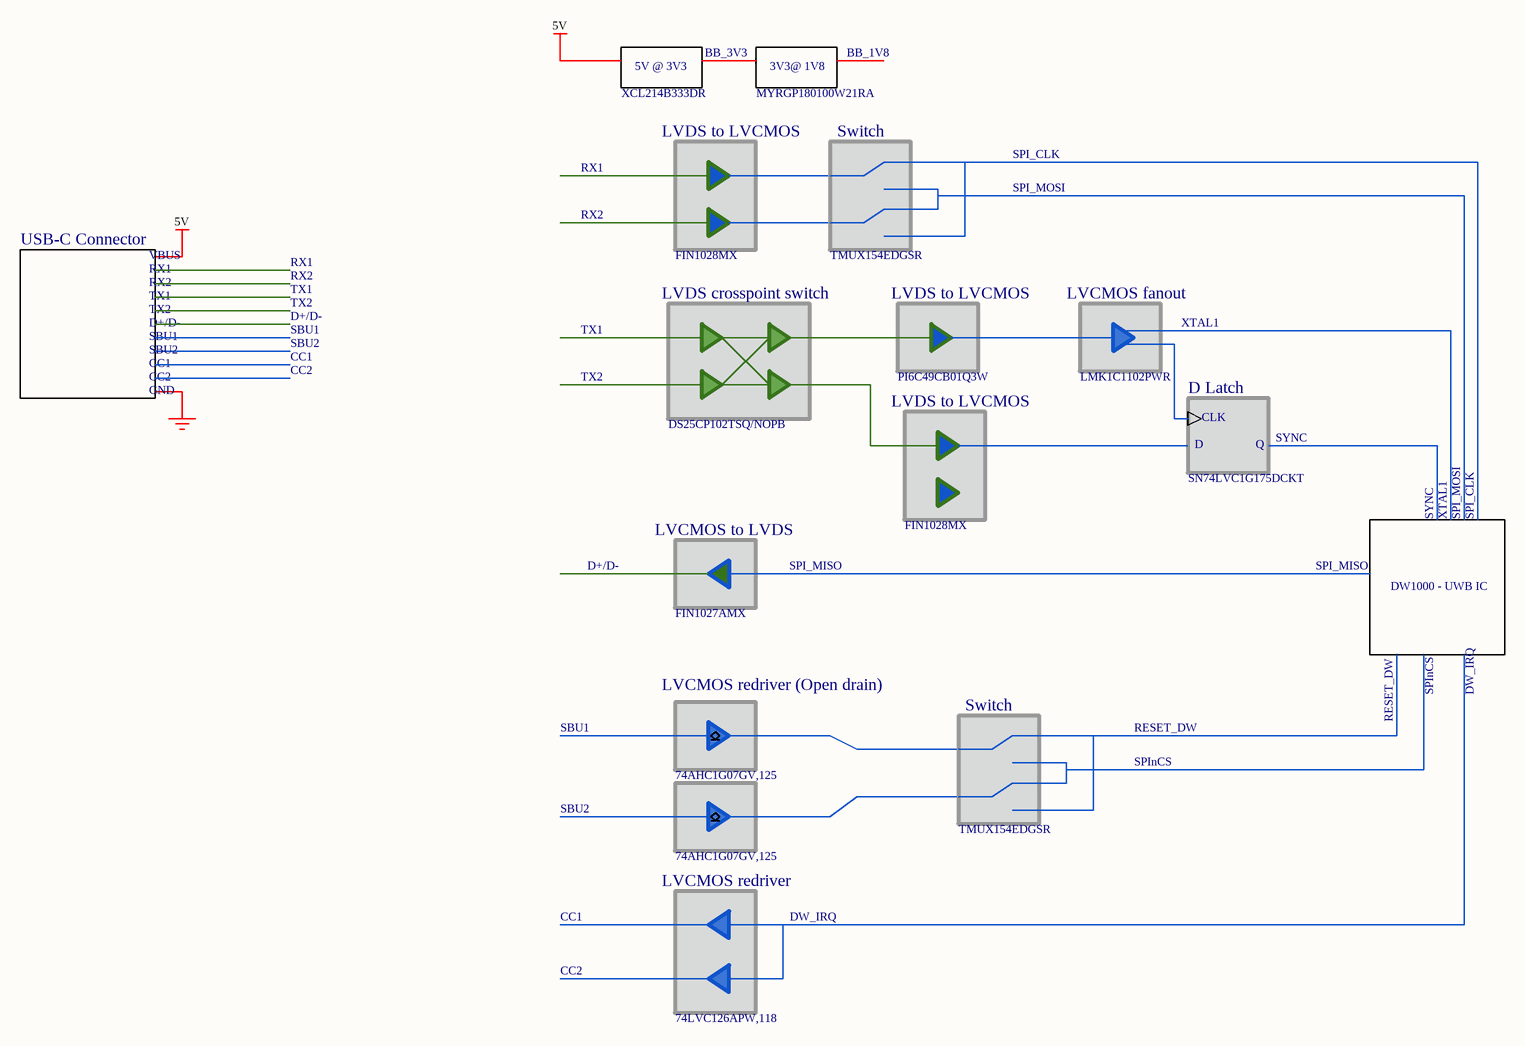
[diagram p6: BEE_BOARD_BLOCK_DIAG.SchDoc]

### Notes on the sheet
- 5V
- 5V @ 3V3
- BB_3V3
- 3V3@ 1V8
- BB_1V8
- XCL214B333DR
- LVDS to LVCMOS
- MYRGP180100W21RA
- Switch
- RX1
- SPI_CLK
- SPI_MOSI
- USB-C Connector
- VBUS
- RX2
- FIN1028MX
- TMUX154EDGSR
- TX1
- TX2
- D+/D-
- SBU1
- LVDS crosspoint switch
- LVCMOS fanout
- XTAL1
- CC1
- CC2
- SBU2
- GND
- PI6C49CB01Q3W
- LMK1C1102PWR
- D Latch
- DS25CP102TSQ/NOPB
- D
- CLK
- Q
- SYNC
- LVCMOS to LVDS
- SN74LVC1G175DCKT
- SPI_MISO
- DW1000 - UWB IC
- FIN1027AMX
- LVCMOS redriver (Open drain)
- RESET_DW
- SPInCS
- DW_IRQ
- 74AHC1G07GV,125
- LVCMOS redriver
- 74LVC126APW,118
- Sheet Name
- Project Title
- Global Project
- Size
- Group
- Revision
- Date
- Sheet
- of
- Filename
- Designers

## Nets that join several sheets
1V8: BEE_BOARD_POWER (6 pins), BEE_BOARD_DECAWAVE (6 pins)
3V3: BEE_BOARD_POWER (14 pins), BEE_BOARD_RECEIVE (40 pins), BEE_BOARD_DECAWAVE (13 pins), BEE_BOARD_USB_C_POLARITY (15 pins)
5V: BEE_BOARD_TOP (5 pins), BEE_BOARD_POWER (6 pins)
GND: BEE_BOARD_TOP (20 pins), BEE_BOARD_POWER (22 pins), BEE_BOARD_RECEIVE (49 pins), BEE_BOARD_DECAWAVE (46 pins), BEE_BOARD_USB_C_POLARITY (11 pins)
CC1: BEE_BOARD_TOP (D5.2 D5.9 J1.A5), BEE_BOARD_RECEIVE (U6.3), BEE_BOARD_USB_C_POLARITY (CC1.1 R25.1 U16.4 U16.6)
CC2: BEE_BOARD_TOP (D2.4 D2.7 J1.B5), BEE_BOARD_RECEIVE (U6.6), BEE_BOARD_USB_C_POLARITY (CC2.1 R26.2 U16.11)
CLK_OUT: BEE_BOARD_RECEIVE (U13.8), BEE_BOARD_DECAWAVE (U19.3)
D_N: BEE_BOARD_TOP (D5.5 D5.6 J1.A7 J1.B7), BEE_BOARD_RECEIVE (U7.5)
D_P: BEE_BOARD_TOP (D5.4 D5.7 J1.A6 J1.B6), BEE_BOARD_RECEIVE (U7.6)
DW_IRQ_BB: BEE_BOARD_RECEIVE (U6.2 U6.5), BEE_BOARD_DECAWAVE (U19.45)
DW_RESET_BB: BEE_BOARD_RECEIVE (U9.2 U9.7), BEE_BOARD_DECAWAVE (U19.27)
PULSE: BEE_BOARD_POWER (R42.1 U2.6), BEE_BOARD_RECEIVE (R8.2), BEE_BOARD_USB_C_POLARITY (Pulse.1 U18.1)
RX1_N: BEE_BOARD_TOP (D3.5 D3.6 J1.A3), BEE_BOARD_RECEIVE (R6.2 U8.3)
RX1_P: BEE_BOARD_TOP (D3.4 D3.7 J1.A2), BEE_BOARD_RECEIVE (R6.1 U8.4)
RX2_N: BEE_BOARD_TOP (D3.2 D3.9 J1.B3), BEE_BOARD_RECEIVE (R5.1 U8.2)
RX2_P: BEE_BOARD_TOP (D3.1 D3.10 J1.B2), BEE_BOARD_RECEIVE (R5.2 U8.1)
SBU1: BEE_BOARD_TOP (D5.1 D5.10 J1.B8), BEE_BOARD_RECEIVE (R12.1 U4.2)
SBU2: BEE_BOARD_TOP (D2.5 D2.6 J1.A8), BEE_BOARD_RECEIVE (R9.1 U5.2)
SEL: BEE_BOARD_RECEIVE (U9.1 U14.8), BEE_BOARD_USB_C_POLARITY (SEL.1 U18.5)
SEL#: BEE_BOARD_RECEIVE (U10.1 U14.7), BEE_BOARD_USB_C_POLARITY (SEL#.1 U18.3)
SPICLK: BEE_BOARD_TOP (J2.5), BEE_BOARD_RECEIVE (U10.2 U10.7), BEE_BOARD_DECAWAVE (U19.41)
SPIMISO: BEE_BOARD_TOP (J2.4), BEE_BOARD_RECEIVE (U7.3), BEE_BOARD_DECAWAVE (U19.40)
SPIMOSI: BEE_BOARD_TOP (J2.3), BEE_BOARD_RECEIVE (U10.3 U10.8), BEE_BOARD_DECAWAVE (U19.39)
SPInCS: BEE_BOARD_TOP (J2.6), BEE_BOARD_RECEIVE (R41.1 U9.3 U9.8), BEE_BOARD_DECAWAVE (U19.24)
SYNC: BEE_BOARD_RECEIVE (SYNC.2 U15.4), BEE_BOARD_DECAWAVE (U19.29)
TX1_N: BEE_BOARD_TOP (D4.2 D4.9 J1.B10), BEE_BOARD_RECEIVE (R22.1 U14.4)
TX1_P: BEE_BOARD_TOP (D4.1 D4.10 J1.B11), BEE_BOARD_RECEIVE (R22.2 U14.3)
TX2_N: BEE_BOARD_TOP (D4.5 D4.6 J1.A10), BEE_BOARD_RECEIVE (R21.1 U14.2)
TX2_P: BEE_BOARD_TOP (D4.4 D4.7 J1.A11), BEE_BOARD_RECEIVE (R21.2 U14.1)